# EAGLE design current_monitor_v1-1 (EAGLE 6.5.0)
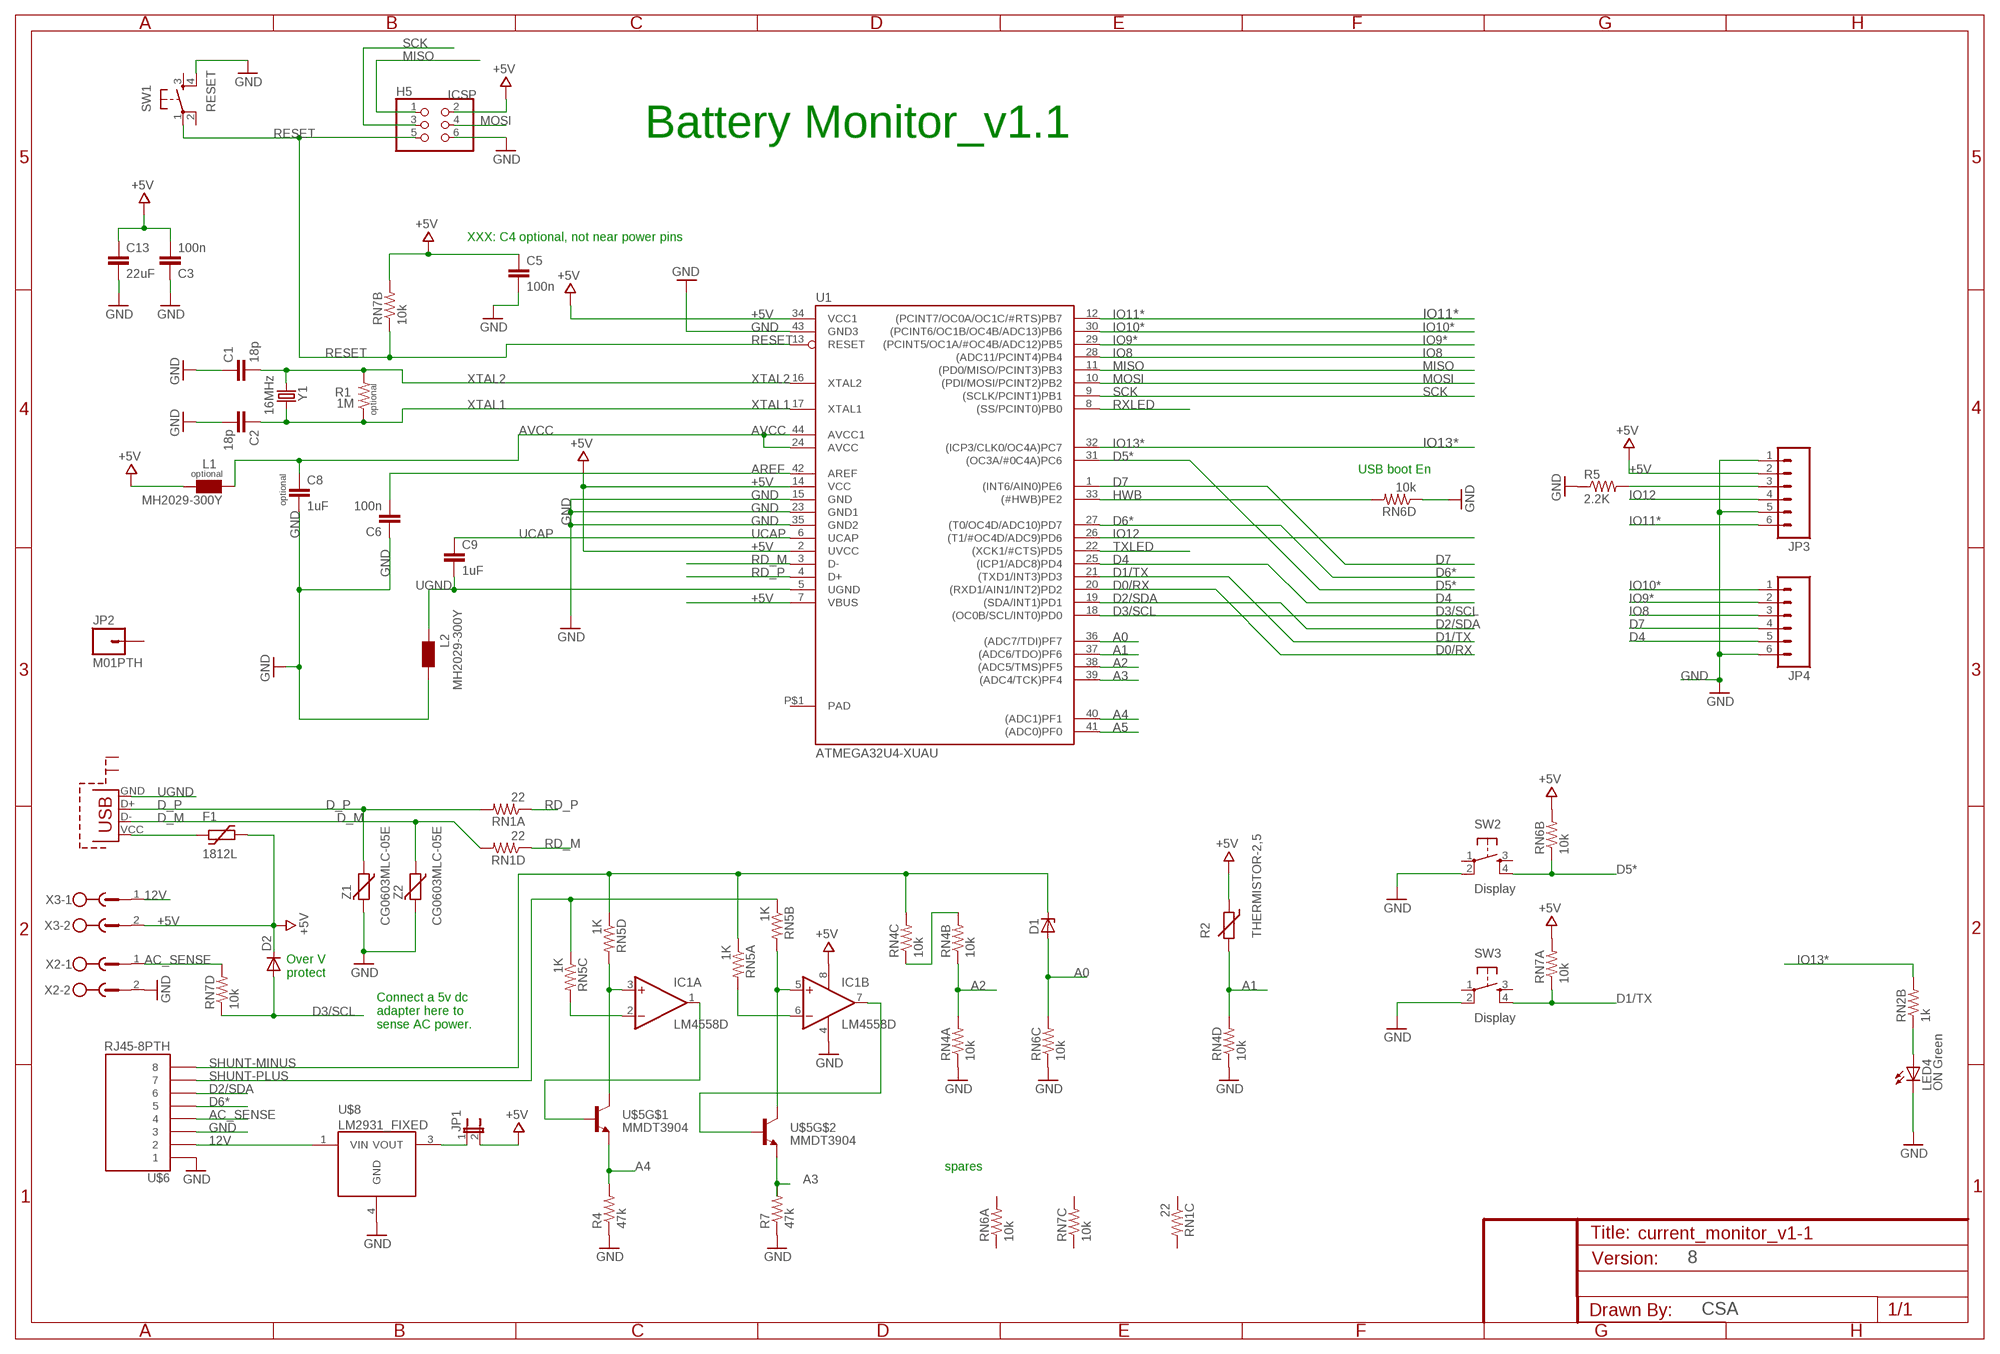
[diagram p0: schematic, sheet 1]

## Parts
C1  18p  CAP0805  [0805]
C2  18p  CAP0805  [0805]
C3  100n  CAP0805  [0805]
C5  100n  CAP0805  [0805]
C6  100n  CAP0805  [0805]
C8  1uF  CAP0805  [0805]
C9  1uF  CAP0805  [0805]
C13  22uF  CAP1206  [1206]
D1  ZENER-DIODEZD-5  [ZDIO-5]
D2  DIODESMA  [SMA-DIODE]
F1  1812L  [1812L]
H5  ICSP  PINHD-2X3  [2X03]
IC1  LM4558D  [SO08]
JP1  JUMPER-2-OLDPTH_LOCK  [1X02_LOCK]
JP2  M01PTH  [1X01]
JP3  M06FEMALE_LOCK  [1X06_FEMALE_LOCK.010]
JP4  M06FEMALE_LOCK  [1X06_FEMALE_LOCK.010]
L1  MH2029-300Y  WE-CBF_0805  [0805]
L2  MH2029-300Y  WE-CBF_0805  [0805]
LED4  ON Green  LED0805  [LED0805]
R1  1M  RESISTOR0805-RES  [0805]
R2  THERMISTOR-2,5  [RS-2,5]
R4  47k  RESISTOR0805-RES  [0805]
R5  2.2K  RESISTOR0805-RES  [0805]
R7  47k  RESISTOR0805-RES  [0805]
RN1  22  RESISTOR-ARRAYCRA06S  [CRA06S]
RN2  1k  RESISTOR-ARRAYCRA06S  [CRA06S]
RN4  10k  RESISTOR-ARRAYCRA06S  [CRA06S]
RN5  1K  RESISTOR-ARRAYCRA06S  [CRA06S]
RN6  10k  RESISTOR-ARRAYCRA06S  [CRA06S]
RN7  10k  RESISTOR-ARRAYCRA06S  [CRA06S]
SW1  RESET  TAC_SWITCHPTH  [TACTILE-PTH]
SW2  Display  TAC_SWITCHPTH  [TACTILE-PTH]
SW3  Display  TAC_SWITCHPTH  [TACTILE-PTH]
U1  ATMEGA32U4-XUAU  [TQFP44-PAD]
U$5  MMDT3904  [SOT363]
U$6  RJ45-8PTH  [RJ45-8]
U$8  LM2931_FIXED  [DPAK]
U$12  USB-MICRO-B-UNIVERSAL  [USB-MICRO-B-UNIVERSAL]
X2  MSTBV2  [MSTBV2]
X3  MSTBV2  [MSTBV2]
Y1  16MHz  CRYSTALHC49US  [HC49US]
Z1  CG0603MLC-05E  VARISTORCN0603  [CT/CN0603]
Z2  CG0603MLC-05E  VARISTORCN0603  [CT/CN0603]

## Nets
12V: U$6.2 U$8.1(VIN) X3.1
+5V [power]: C3.2 C5.1 C13.1 D2.C F1.P$2 H5.2 IC1.8(P:V+) JP1.2 JP3.2 L1.1 R2.1 RN6.7 RN7.7 RN7.8 U1.2(UVCC) U1.7(VBUS) U1.14(VCC) U1.34(VCC1) X3.2
A0: D1.A RN6.6 U1.36((ADC7/TDI)PF7)
A1: R2.2 RN4.5 U1.37((ADC6/TDO)PF6)
A2: RN4.2 RN4.8 U1.38((ADC5/TMS)PF5)
A3: R7.2 U1.39((ADC4/TCK)PF4) U$5.1(E)
A4: R4.2 U1.40((ADC1)PF1) U$5.4(E)
A5: U1.41((ADC0)PF0)
AC_SENSE: RN7.5 U$6.4 X2.1
AREF [aref]: C6.2 U1.42(AREF)
AVCC: C8.1 L1.2 U1.24(AVCC) U1.44(AVCC1)
D0/RX: U1.20((RXD1/AIN1/INT2)PD2)
D1/TX: RN7.1 SW3.4 U1.21((TXD1/INT3)PD3)
D2/SDA: U1.19((SDA/INT1)PD1) U$6.6
D3/SCL: D2.A RN7.4 U1.18((OC0B/SCL/INT0)PD0)
D4: JP4.5 U1.25((ICP1/ADC8)PD4)
D5*: RN6.2 SW2.4 U1.31((OC3A/#0C4A)PC6)
D6*: U1.27((T0/OC4D/ADC10)PD7) U$6.5
D7: JP4.4 U1.1((INT6/AIN0)PE6)
D_M: RN1.5 U$12.D- Z2.1
D_P: RN1.8 U$12.D+ Z1.1
GND [gnd]: C1.1 C2.2 C3.1 C5.2 C6.1 C8.2 C13.2 H5.6 IC1.4(P:V-) JP3.1 JP3.5 JP4.6 L2.2 LED4.C R4.1 R5.1 R7.1 RN4.1 RN4.4 RN6.3 RN6.4 SW1.4 SW2.2 SW3.2 U1.15(GND) U1.23(GND1) U1.35(GND2) U1.43(GND3) U$6.1 U$6.3 U$8.4(GND) X2.2 Z1.2 Z2.2
HWB: RN6.5 U1.33((#HWB)PE2)
IO8: JP4.3 U1.28((ADC11/PCINT4)PB4)
IO9*: JP4.2 U1.29((PCINT5/OC1A/#OC4B/ADC12)PB5)
IO10*: JP4.1 U1.30((PCINT6/OC1B/OC4B/ADC13)PB6)
IO11*: JP3.6 U1.12((PCINT7/OC0A/OC1C/#RTS)PB7)
IO12: JP3.4 U1.26((T1/#OC4D/ADC9)PD6)
IO13*: RN2.7 U1.32((ICP3/CLK0/OC4A)PC7)
LED4_ANODE: LED4.A RN2.2
MISO: H5.1 U1.11((PD0/MISO/PCINT3)PB3)
MOSI: H5.4 U1.10((PDI/MOSI/PCINT2)PB2)
N$1: IC1.5(B:+IN) RN5.7 U$5.6(C)
N$2: IC1.2(A:-IN) RN5.6
N$3: IC1.6(B:-IN) RN5.8
N$4: IC1.1(A:OUT) U$5.5(B)
N$5: IC1.7(B:OUT) U$5.2(B)
N$6: IC1.3(A:+IN) RN5.5 U$5.3(C)
N$7: F1.P$1 U$12.VCC(VBUS)
N$8: JP1.1 U$8.3(VOUT)
N$10: RN4.3 RN4.7
N$12: JP3.3 R5.2
RD_M: RN1.4 U1.3(D-)
RD_P: RN1.1 U1.4(D+)
RESET: H5.5 RN7.2 SW1.1 U1.13(RESET)
RXLED: U1.8((SS/PCINT0)PB0)
SCK: H5.3 U1.9((SCLK/PCINT1)PB1)
SHUNT-MINUS: D1.C RN4.6 RN5.1 RN5.4 U$6.8
SHUNT-PLUS: RN5.2 RN5.3 U$6.7
TXLED: U1.22((XCK1/#CTS)PD5)
UCAP: C9.1 U1.6(UCAP)
UGND [gnd]: C9.2 L2.1 U1.5(UGND) U$12.GND
XTAL1: C2.1 R1.1 U1.17(XTAL1) Y1.2
XTAL2: C1.2 R1.2 U1.16(XTAL2) Y1.1
Unconnected: JP2.1 RN1.2 RN1.3 RN1.6 RN1.7 RN2.1 RN2.3 RN2.4 RN2.5 RN2.6 RN2.8 RN6.1 RN6.8 RN7.3 RN7.6 SW1.2 SW1.3 SW2.1 SW2.3 SW3.1 SW3.3 U$12.P$7(SHIELD1) U$12.P$8(SHIELD2)

## Notes on the sheet
- Battery Monitor_v1.1
- XXX: C4 optional, not near power pins
- optional
- USB boot En
- optional
- optional
- Over V
  protect
- Connect a 5v dc
  adapter here to 
  sense AC power.
- spares
- 8
- CSA

## Power pins joined to a net without a drawn wire
PAD: U1.P$1(PAD)

## Library data of the parts
C1-C3 C5 C6 C8 C9 C13 = SparkFun-Passives:CAP: Capacitor Standard 0603 ceramic capacitor, and 0.1" leaded capacitor.
D1 = diode:ZENER-DIODE: Z-Diode
D2 = SparkFun-DiscreteSemi:DIODE: Diode These are standard reverse protection diodes and small signal diodes. SMA package can handle up to about 1A. SOD-323 can handle about 200mA. What the SOD-323 package when ordering, there are some mfgs out there that are 5-pin packages.
F1 = ptc-littlefuse:1812L
H5 = SmartPrj:PINHD-2X3: PIN HEADER
IC1 = linear:*4558: OP AMP
JP1 = SparkFun-Passives:JUMPER-2-OLD: Jumper Basic 0.1" spaced jumper. Use with breakaway headers.
JP2 = SparkFun-Connectors:M01: Header 1 Standard 1-pin 0.1" header. Use with straight break away headers (SKU : PRT-00116), right angle break away headers (PRT-00553), swiss pins (PRT-00743), machine pins (PRT-00117), and female headers (PRT-00115).
JP3 JP4 = SparkFun-Connectors:M06: Header 6 Standard 6-pin 0.1" header. Use with straight break away headers (SKU : PRT-00116), right angle break away headers (PRT-00553), swiss pins (PRT-00743), machine pins (PRT-00117), and female headers (PRT-00115). Molex polarized connector foot print use with SKU : PRT-08094 with associated crimp pins and housings. NOTES ON THE VARIANTS LOCK and LOCK_LONGPADS... This footprint was designed to help hold the alignment of a through-hole component (i.e. 6-pin header) while soldering it into place. You may notice that each hole has been shifted either up or down by 0.005 of an inch from it's more standard position (which is a perfectly straight line). This slight alteration caused the pins (the squares in the middle) to touch the edges of the holes. Because they are alternating, it causes a "brace" to hold the component in place. 0.005 has proven to be the perfect amount of "off-center" position when using our standard breakaway headers. Although looks a little odd when you look at the bare footprint, once you have a header in there, the alteration is very hard to notice. Also, if you push a header all the way into place, it is covered up entirely on the bottom side. This idea of altering the position of holes to aid alignment will be further integrated into the Sparkfun Library for other footprints. It can help hold any component with 3 or more connection pins.
L1 L2 = wuerth-elektronik:WE-CBF: SMD EMI Suppression Ferrite Beads - excellent anti-EMI properties - low DCR - impedances till 3000 ohms - rated current up to 6 A
LED4 = xorduino:LED
R1 R4 R5 R7 = SparkFun-Passives:RESISTOR: Resistor Basic schematic elements and footprints for 0603, 1206, and PTH resistors.
R2 = varistor:THERMISTOR: THERMISTOR
RN1 RN2 RN4-RN7 = xorduino:RESISTOR-ARRAY
SW1-SW3 = SparkFun-Electromechanical:TAC_SWITCH: Momentary Switch Button commonly used for reset or general input. Spark Fun Electronics SKU : COM-00097
U1 = SmartPrj:ATMEGA32U4-XU
U$5 = SparkFun-DiscreteSemi:MMDT3904: Dual NPN transistor
U$6 = SparkFun-Connectors:RJ45-8: RJ45 Jack Simple RJ45, 8-pin connection - connector for common Cat5, Cat5e, and Cat6 Ethernet cables. Footprint not yet proven in production. Connector sku is PRT-00643; Breakout PCB sku is BOB-00716.
U$8 = SparkFun-PowerIC:LM2931_FIXED: LDO regulator with reverse battery protection- very durable!
U$12 = _usb_micro_b:USB-MICRO-B: USB MICRO B SOCKET 2 shielded pins
X2 X3 = con-phoenix-500:MSTBV2: PHOENIX; OC_FARNELL: unknown; OC_NEWARK: unknown
Y1 = SparkFun-FreqCtrl:CRYSTAL: Various standard crystals. Proven footprints. Spark Fun Electronics SKU : COM-00534
Z1 Z2 = varistor:VARISTOR: VARISTOR

## Net classes
0 default: width 0.203 mm, drill 0.406 mm, clearance 0.205 mm
1 power: width 0.203 mm, drill 0.406 mm, clearance 0.205 mm to class 0, clearance 0.205 mm
2 gnd: width 0.203 mm, drill 0.406 mm, clearance 0.205 mm to class 0, clearance 0.205 mm to class 1, clearance 0.205 mm
3 usbvcc: width 0.203 mm, drill 0.406 mm, clearance 0.203 mm
4 aref: width 0.203 mm, drill 0.406 mm, clearance 0.205 mm to class 0, clearance 0.205 mm to class 1, clearance 0.205 mm to class 2, clearance 0.205 mm to class 3, clearance 0.205 mm

## Board
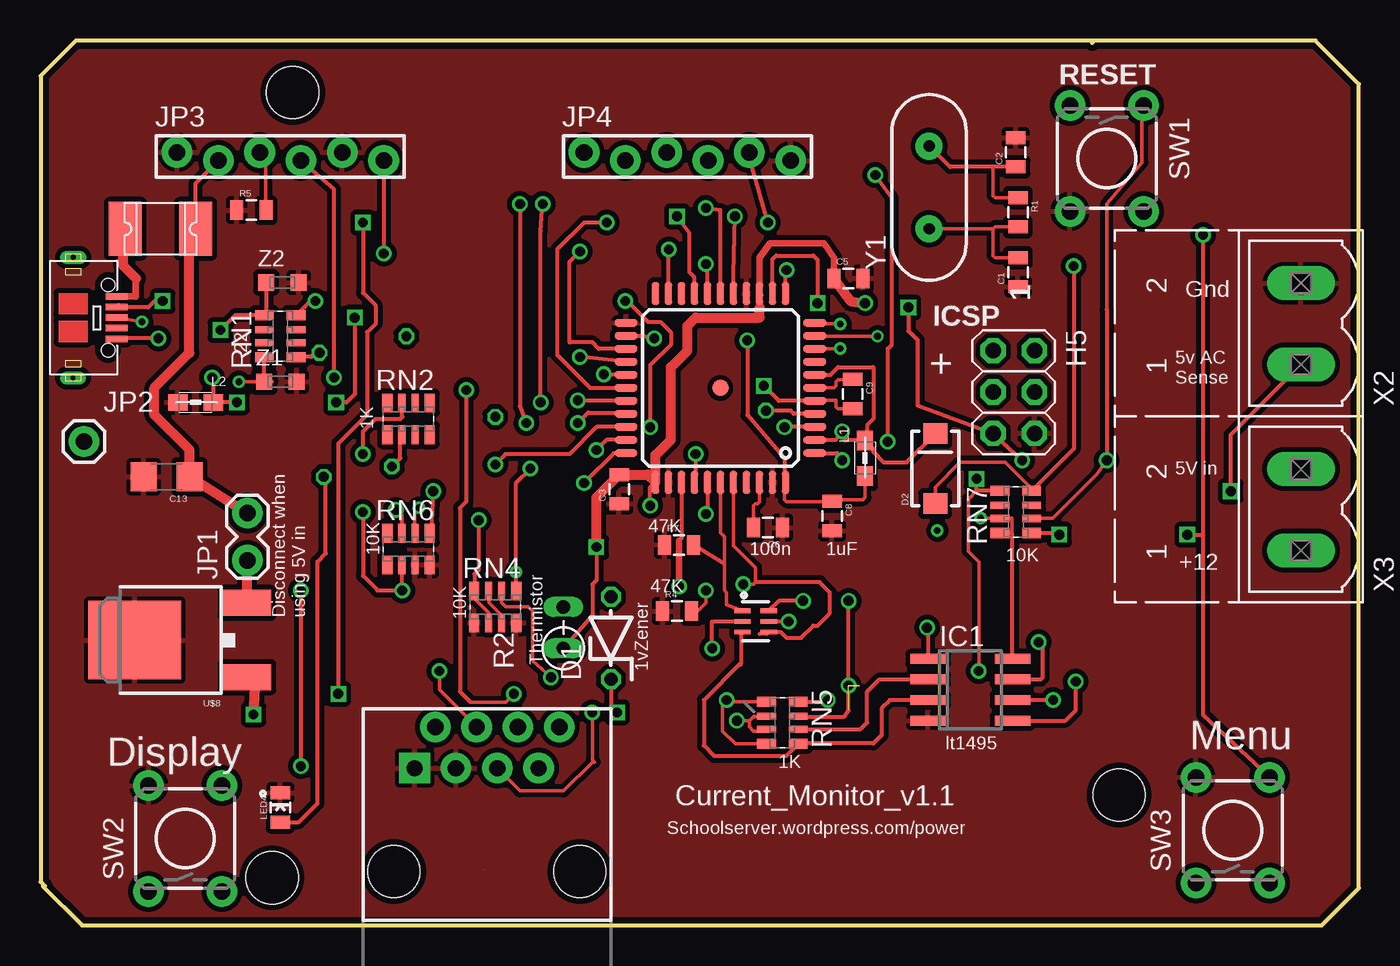
[diagram p1: board, top side]
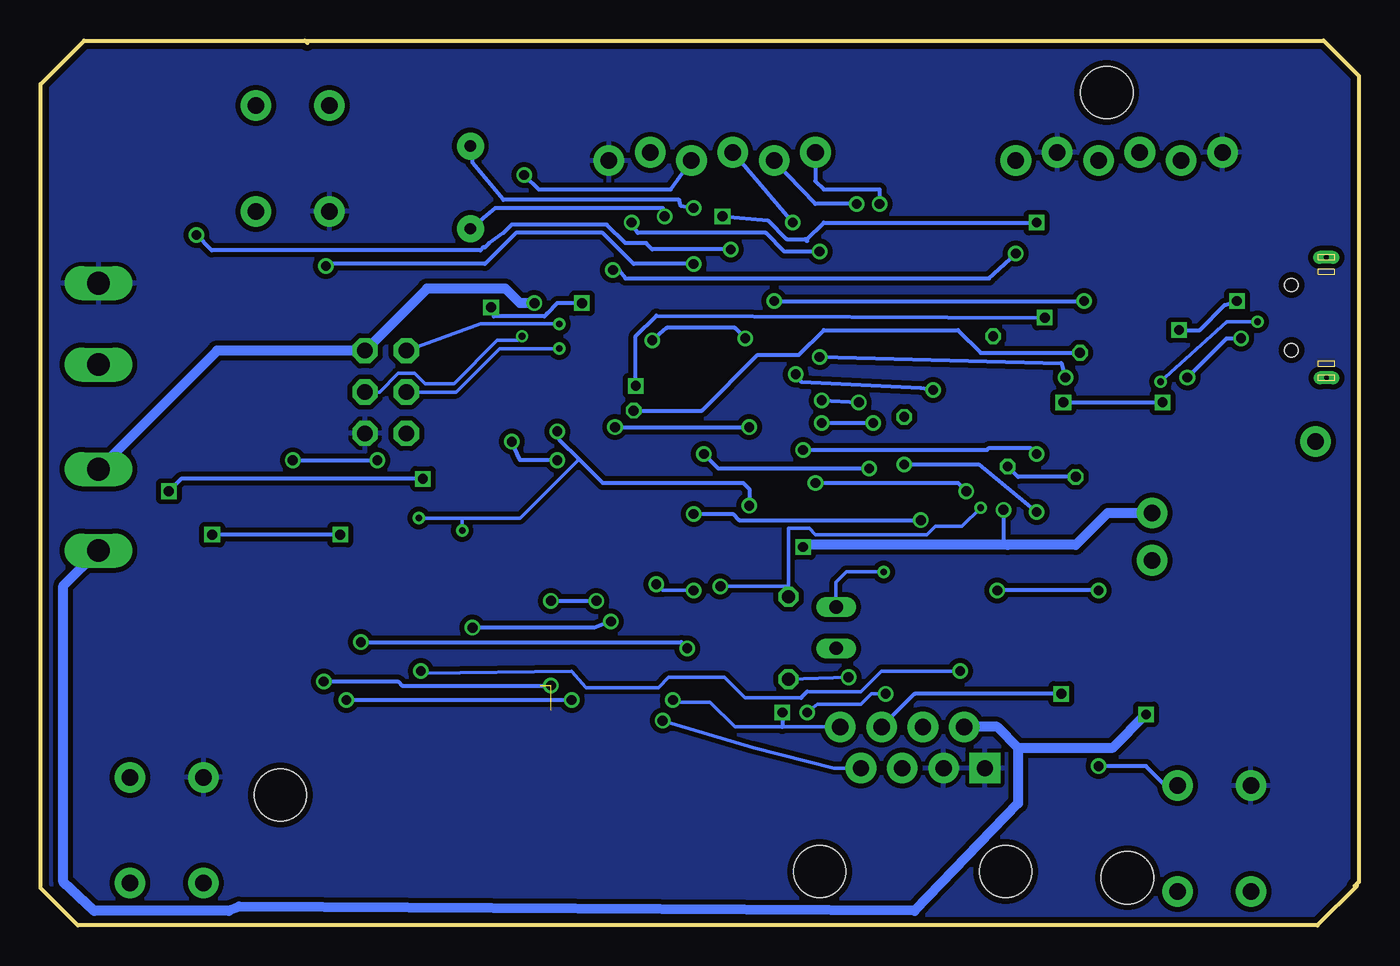
[diagram p2: board, bottom side, seen from below]

Size 81.03 x 54.36 mm. Coordinates in mm from the lower left corner, seen from the top.
Outline: 0.13,2.54 0.13,2.41 2.54,0 78.74,0 81.03,2.29 81.03,51.69 78.36,54.36 64.77,54.36
Outline: 64.77,54.36 2.16,54.36 0,52.2 0,2.67 0.25,2.41
Outline: 64.77,54.36 64.64,54.23
Copper layers (1*16): Top 0.0356mm / dielectric 1.5011mm / Bottom 0.0356mm
Design rules "LaenPCBOrder": minimum track width 6mil, minimum drill 13mil, track to track 6mil, track to pad 6mil, pad to pad 6mil, via to via 6mil, smd to smd 6mil, copper to edge 15mil, drill to drill 6mil, minimum pad ring 7mil, minimum via ring 7mil, stop-mask expansion 4mil, vias tented up to drill 0mil, thermal gap 10mil
Holes 3.2 mm at 66.29,8 15.49,51.18 14.22,2.92

### Footprints (pad centres in the part's own frame; a part is rotated, then mirrored left to right if it is on the bottom)
0805 = smd 0.8 x 1.2: 1 -0.9,0; 2 0.9,0
1206 = smd 1.6 x 1.8: 1 -1.4,0; 2 1.4,0
ZDIO-5 = drill 0.813 octagon: A 2.54,0; C -2.54,0
SMA-DIODE = smd 1.27 x 1.47: A -2.15,0; C 2.15,0
1812L = smd 2.03 x 3.3: P$1 -2.16,0; P$2 2.16,0
2X03 = drill 0.95 pad 1.55 octagon: 1 -2.54,-1.27; 2 -2.54,1.27; 3 0,-1.27; 4 0,1.27; 5 2.54,-1.27; 6 2.54,1.27
SO08 = smd 0.6 x 2.2: 1 -1.905,-2.6; 2 -0.635,-2.6; 3 0.635,-2.6; 4 1.905,-2.6; 5 1.905,2.6; 6 0.635,2.6; 7 -0.635,2.6; 8 -1.905,2.6
1X02_LOCK = drill 1.016 pad 1.88: 1 -0.178,0; 2 2.718,0
1X01 = drill 1.016 pad 1.88: 1 0,0
1X06_FEMALE_LOCK.010 = drill 1.016 pad 1.88: 1 0,0.254; 2 2.54,-0.254; 3 5.08,0.254; 4 7.62,-0.254; 5 10.16,0.254; 6 12.7,-0.254
0805' = smd 1.2 x 1: 1 -1.1,0; 2 1.1,0
LED0805 = smd 0.8 x 1.2: A -0.9,0; C 0.9,0
RS-2,5 = drill 0.813 long: 1 -1.27,0; 2 1.27,0
CRA06S = smd 0.63 x 1.15: 1 -1.295,-0.975; 4 1.295,-0.975; 5 1.295,0.975; 8 -1.295,0.975 | smd 0.44 x 1.15: 2 -0.4,-0.975; 3 0.4,-0.975; 6 0.4,0.975; 7 -0.4,0.975
TACTILE-PTH = drill 1.016 pad 1.88: 1 -3.251,2.261; 2 3.251,2.261; 3 -3.251,-2.261; 4 3.251,-2.261
TQFP44-PAD = smd 1.4 x 0.45: 1 -5.8,4; 2 -5.8,3.2; 3 -5.8,2.4; 4 -5.8,1.6; 5 -5.8,0.8; 6 -5.8,0; 7 -5.8,-0.8; 8 -5.8,-1.6; 9 -5.8,-2.4; 10 -5.8,-3.2; 11 -5.8,-4; 23 5.8,-4; 24 5.8,-3.2; 25 5.8,-2.4; 26 5.8,-1.6; 27 5.8,-0.8; 28 5.8,0; 29 5.8,0.8; 30 5.8,1.6; 31 5.8,2.4; 32 5.8,3.2; 33 5.8,4 | smd 0.45 x 1.4: 12 -4,-5.8; 13 -3.2,-5.8; 14 -2.4,-5.8; 15 -1.6,-5.8; 16 -0.8,-5.8; 17 0,-5.8; 18 0.8,-5.8; 19 1.6,-5.8; 20 2.4,-5.8; 21 3.2,-5.8; 22 4,-5.8; 34 4,5.8; 35 3.2,5.8; 36 2.4,5.8; 37 1.6,5.8; 38 0.8,5.8; 39 0,5.8; 40 -0.8,5.8; 41 -1.6,5.8; 42 -2.4,5.8; 43 -3.2,5.8; 44 -4,5.8 | smd 1 x 1: P$1 0,0
SOT363 = smd 0.3 x 0.99: 1 -0.65,-0.8; 2 0,-0.8; 3 0.65,-0.8; 4 0.65,0.81; 5 0,0.81; 6 -0.65,0.81
RJ45-8 = drill 1 pad 1.88 square: 1 -4.445,6.35 | drill 1 pad 1.88: 2 -3.175,8.89; 3 -1.905,6.35; 4 -0.635,8.89; 5 0.635,6.35; 6 1.905,8.89; 7 3.175,6.35; 8 4.445,8.89 | hole 3.2: -5.715,0; 5.715,0
DPAK = smd 1.6 x 3: 1 -2.28,-5.31; 3 2.28,-5.31 | smd 4.826 x 5.715: 4 0,1.588
USB-MICRO-B-UNIVERSAL = smd 0.4 x 1.35: D+ 0,-0.03; D- -0.65,-0.03; GND 1.3,-0.03; ID 0.65,-0.03; VCC -1.3,-0.03 | drill 0.3 pad 0.813 long: P$7 3.7,-2.71; P$8 -3.7,-2.7 | hole 0.8: -2,-0.55; 2,-0.55
MSTBV2 = drill 1.397 long: 1 -2.5,0; 2 2.5,0
HC49US = drill 0.7 pad 1.651: 1 -2.54,0; 2 2.54,0
CT/CN0603 = smd 1 x 1: 1 -1,0; 2 1,0

### Placement (x,y rotation side)
C1  60.07,40.13 90 top
C2  59.94,47.5 90 top
C3  35.56,26.8 90 top
C5  49.66,39.75 0 top
C6  44.7,24.43 180 top
C8  48.64,25.15 270 top
C9  49.91,32.64 270 top
C13  7.75,27.56 180 top
D1  35.05,17.65 90 top
D2  54.99,28.07 90 top
F1  7.37,42.8 0 top
H5  59.82,32.77 270 top
IC1  57.15,14.48 270 top
JP1  12.7,22.61 90 top
JP2  2.67,29.72 0 top
JP3  8.38,47.24 0 top
JP4  33.4,47.24 0 top
L1  MH2029-300Y  [0805']  50.67,28.7 270 top
L2  MH2029-300Y  [0805']  9.53,32.13 180 top
LED4  14.73,7.24 90 top
R1  60.07,43.81 270 top
R2  32.13,18.29 90 top
R4  39.12,19.3 0 top
R5  12.95,43.94 0 top
R7  39.24,23.37 0 top
RN1  14.73,36.2 90 top
RN2  22.61,31.12 0 top
RN4  27.94,19.56 0 top
RN5  45.59,12.45 270 top
RN6  22.61,23.11 0 top
RN7  59.94,25.4 90 top
SW1  65.53,47.12 270 top
SW2  8.89,5.33 90 top
SW3  73.28,5.84 90 top
U1  41.78,33.02 180 top
U$5  43.94,18.67 270 top
U$6  27.43,3.3 0 top
U$8  7.37,17.53 90 top
U$12  4.7,37.34 270 top
X2  77.47,36.96 90 top
X3  77.47,25.53 90 top
Y1  54.61,45.34 90 top
Z1  14.73,33.4 0 top
Z2  14.86,39.5 0 top

### Tracks (layer width: path | path; a pad name or v marks a point on that pad's centre or on a via)
12V  (via drill 0.6)
  Top 0.254: U$8.1 12.68,15.14 12.7,15.11 12.7,15.24 13.08,15.24 13.21,15.11
  Top 0.61: v13.08,12.95 13.21,15.11
  Bottom 0.61: 20.96,10.92 22.23,12.19 U$6.2 | 20.96,10.92 20.96,7.49 27.3,0.89 68.83,1.14 69.47,0.89 77.72,0.89 79.63,2.67 79.63,20.87 X3.1 | 20.96,10.92 15.11,10.92 v13.08,12.95
+5V  (via drill 0.41, 0.6)
  Top 0.203: 44.07,38.61 44.2,38.73 U1.14 | RN7.8 59.06,24.13 59.69,24.13 59.69,25.02 59.06,25.02 RN7.7 58.93,25.02 v57.78,25.02
  Top 0.254: 44.2,38.83 U1.14 44.24,38.82 44.32,38.73 | 48.77,39.74 C5.1 | U1.2 48.87,29.82 v49.28,30.35 49.45,29.8 L1.1 | v37.47,25.78 37.47,26.9 U1.34 | U1.7 48.55,33.82 49.02,34.29 51.18,34.29 51.18,31.12 50.8,30.73 50.8,29.93 L1.1 | v34.16,23.24 34.16,21.21 33.91,20.96 33.91,19.05 R2.1 | RN6.7 22.21,25.16 v21.84,25.53 | JP3.2 9.53,45.59 F1.P$2 9.14,42.42 | D2.C 53.22,28.45 51.82,28.45 51.18,29.08 51.18,29.29 L1.1 | 59.69,24.13 59.69,16.44 IC1.8
  Top 0.305: 44.2,37.97 44.2,38.81 U1.14
  Top 0.406: C5.1 48.76,41.03 48.13,41.91 44.83,41.91 44.2,41.02 44.2,38.83
  Top 0.61: JP1.2 C13.1 9.15,29.21 6.99,31.37 6.99,33.02 9.14,35.18 9.14,42.42 | v34.16,23.24 34.16,26.3 C3.2 37.31,27.7 U1.34 37.78,28.89 38.73,29.84 38.73,34.29 39.75,35.31 39.75,36.83 40.26,37.34 44.2,37.34 44.2,37.97 | 48.77,39.74 49.78,38.35 v50.67,38.23
  Bottom 0.203: 55.12,25.02 51.56,25.02 47.94,28.64 | 55.12,25.02 v57.78,25.02 | 55.12,25.02 v55.12,24.26
  Bottom 0.254: v49.28,30.35 49.15,29.84 47.94,28.64 46.48,27.18 37.85,27.18 37.47,26.8 v37.47,25.78 | v21.84,25.53 21.84,23.62 21.59,23.37
  Bottom 0.61: JP1.2 15.44,25.32 17.4,23.37 21.59,23.37 34.04,23.37 v34.16,23.24 | v50.67,38.23 51.56,38.23 52.45,39.12 57.28,39.12 H5.2 70.19,35.31 X3.2
A0  (via drill 0.41, 0.6)
  Top 0.203: v23.24,25.65 22.99,25.4 22.99,24.13 RN6.6
  Top 0.254: U1.36 39.38,23.76 39.24,23.62
  Top 0.406: 39.24,23.62 v39.24,20.83
  Bottom 0.203: v23.24,25.65 24.38,24.51 26.04,24.51 26.54,24 33.4,24 33.78,24.38 35.05,24.38 35.05,20.83 | D1.A 35.05,20.83 | 35.05,20.83 v39.24,20.83
A1  (via drill 0.41, 0.6)
  Top 0.203: v29.21,21.72 29.23,21.72
  Top 0.254: RN4.5 29.23,21.72 29.23,27.2 v30.1,28.07 | v40.26,28.96 40.26,27.3 U1.37
  Bottom 0.203: R2.2 32.13,21.08 31.5,21.72 v29.21,21.72
  Bottom 0.254: v30.1,28.07 39.37,28.07 v40.26,28.96
A2  (via drill 0.6)
  Top 0.203: RN4.8 26.67,20.45 26.67,20.07 27.56,19.18 27.56,18.67 RN4.2
  Top 0.254: U1.38 40.98,25.36 v40.89,25.27 | v26.92,24.89 26.92,21.84 26.67,21.59 26.67,20.56 RN4.8
  Bottom 0.254: v40.89,25.27 38.48,25.27 38.1,24.89 v26.92,24.89
A3
  Top 0.203: 42.04,22.23 42.04,20.57 42.16,20.45 42.16,19.68 U$5.1 | U1.39 41.78,24.13 42.04,23.88 42.04,22.23 | 42.04,22.23 R7.2
A4  (via drill 0.6)
  Top 0.203: U1.40 42.58,23.33 43.94,21.97 43.94,21.08 43.82,20.96 v43.18,20.96 | 44.2,17.91 44.64,17.91 | R4.2 40.39,19.3 40.89,19.81 v40.89,20.57
  Top 0.254: U$5.4 44.64,17.91 | 44.2,17.91 44.32,18.03 45.47,18.03 45.85,17.65 46.74,17.65 47.5,18.41 47.75,18.41 48.51,19.18 48.51,20.45 47.88,21.08 43.94,21.08
  Bottom 0.203: v40.89,20.57 42.8,20.57 v43.18,20.96
AC_SENSE  (via drill 0.6)
  Top 0.203: U$6.4 24.51,14.48 v24.51,15.62 | v57.66,15.62 57.66,22.35 57.02,22.99 57.02,26.19 57.53,26.7
  Top 0.254: RN7.5 57.53,26.7 v57.53,27.43 | v73.15,26.67 73.15,30.14 X2.1
  Bottom 0.203: v24.51,15.62 29.34,15.62 30.61,14.35 33.91,14.35 | 34.29,13.97 37.72,13.97 38.99,15.24 42.42,15.24 43.05,14.61 47.5,14.61 48.39,15.62 57.53,15.49 v57.66,15.62
  Bottom 0.254: v57.53,27.43 72.39,27.43 v73.15,26.67 | 33.91,14.35 34.29,13.97
AREF
  Top 0.203: C6.2 43.82,24.51 43.82,25.78 43.94,25.91 44.07,25.91 44.2,26.04 44.2,27.18 U1.42
AVCC  (via drill 0.6)
  Top 0.203: 47.5,26.04 45.85,26.04 45.72,26.16 45.72,27.18 U1.44 | L1.2 50.67,26.29 50.55,26.16 49.28,26.16 49.15,26.04 47.5,26.04 | 47.5,26.04 C8.1
  Top 0.254: U1.24 37.06,36.22 v37.72,36.07 | v43.43,35.94 43.43,31.37 45.72,28.7 45.72,27.28 U1.44
  Bottom 0.254: v37.72,36.07 38.35,36.7 42.55,36.7 v43.43,35.94
D1/TX  (via drill 0.6)
  Top 0.254: U1.21 38.58,41.5 v38.61,41.53 | v71.45,42.42 71.45,24 | 71.45,24 71.45,12.93 SW3.4 | RN7.1 62.61,24.11 v62.61,24 | v70.48,24 71.45,24
  Bottom 0.254: v38.61,41.53 43.43,41.53 43.82,41.91 45.09,41.91 46.23,43.05 52.07,43.05 52.58,42.55 53.47,41.91 53.72,41.66 53.82,41.66 54,41.48 70.51,41.48 v71.45,42.42 | v62.61,24 v70.48,24
D2/SDA  (via drill 0.6)
  Top 0.254: U1.19 40.18,39.83 39.88,40.13 39.88,42.55 v39.12,43.56 | v19.81,43.18 19.81,38.86 20.57,38.1 20.57,36.96 20.07,36.45 20.07,31.37 18.29,29.59 v18.29,14.22
  Bottom 0.254: v39.12,43.56 36.32,43.31 35.18,42.16 34.04,42.16 33.91,42.04 33.91,42.16 32.89,43.18 v19.81,43.18 | v18.29,14.22 27.3,14.22 U$6.6
D3/SCL  (via drill 0.6)
  Top 0.203: RN7.4 60.92,26.84 59.31,28.45 56.52,28.45 54.99,26.92 D2.A
  Top 0.254: U1.18 40.98,40.6 v40.89,40.64 | v63.5,40.51 63.5,29.28 RN7.4
  Bottom 0.254: v40.89,40.64 44.58,40.64 46.48,42.55 51.82,42.55 53.72,40.64 63.37,40.64 v63.5,40.51
D4  (via drill 0.6)
  Top 0.254: U1.25 34.3,35.42 33.91,35.81 32.51,35.81 32.51,40.77 v33.15,41.4 | v44.7,43.18 43.69,46.74 JP4.5
  Bottom 0.254: v33.15,41.4 35.31,41.4 36.45,42.55 44.32,42.55 v44.7,43.18
D5*  (via drill 0.6)
  Top 0.254: RN6.2 22.23,22.12 v22.23,20.57 20.7,20.57 19.81,21.46 v19.81,25.4 | U1.31 34.18,30.62 32.51,28.96 28.58,28.96 v27.94,28.32 | v16,9.78 v16,20.57
  Bottom 0.254: SW2.4 11.89,8.59 13.08,9.78 v16,9.78 | v16,20.57 v22.23,20.57 | v27.94,28.32 23.37,28.32 v19.81,25.4
D6*  (via drill 0.6)
  Top 0.203: 26.42,13.72 28.58,13.72 v29.08,14.22 | v33.91,13.08 33.91,10.16 34.04,10.03 33.91,10.03 32.13,8.25 29.46,8.25 U$6.5
  Top 0.254: U1.27 34.84,33.82 v34.62,33.86 | v26.16,32.89 26.16,26.04 25.78,25.65 25.78,14.35 26.42,13.72
  Bottom 0.203: v29.08,14.22 29.97,14.22 30.61,13.59 33.27,13.59 v33.91,13.08
  Bottom 0.254: v34.62,33.86 34.67,33.78 34.29,33.4 26.92,33.02 v26.16,32.89
D7  (via drill 0.6)
  Top 0.254: U1.1 48.96,29.02 v49.28,28.57 | v52.07,29.72 52.07,35.43 52.32,35.69 52.32,44.7 v51.31,46.1
  Bottom 0.254: v49.28,28.57 51.56,28.57 v52.07,29.72 | v51.31,46.1 50.42,45.21 42.29,45.21 JP4.4
D_M  (via drill 0.6)
  Top 0.254: v11.05,36.58 11.96,37.49 RN1.5 13.86,37.59 Z2.1 | 4.78,38.1 U$12.D- 4.68,37.97 6.6,37.97 6.99,38.35 v7.49,38.35
  Bottom 0.254: v11.05,36.58 9.78,36.58 8.26,38.1 v7.49,38.35
D_P  (via drill 0.41)
  Top 0.203: 14.22,33.4 Z1.1 v12.19,33.4 | v6.22,37.08 U$12.D+
  Top 0.254: Z1.1 13.73,34.88 RN1.8
  Bottom 0.203: v6.22,37.08 8.13,37.08 v12.19,33.4
GND
  pour Bottom (isolate 0.305): 0.25,1.65 0.25,52.45 1.52,53.72 81.15,54.1 81.03,0.13 2.79,0.38
  pour Top (isolate 0.305): 0.25,1.65 0.25,52.45 1.52,53.72 81.28,54.23 80.77,0 2.29,0.38
HWB  (via drill 0.6)
  Top 0.254: U1.33 35.24,29.02 v33.4,27.18 | v24.13,26.67 24,24.19 RN6.5
  Bottom 0.254: v33.4,27.18 24.64,27.18 v24.13,26.67
IO8  (via drill 0.6)
  Top 0.254: v34.8,43.18 33.4,43.18 31.75,41.53 31.75,35.05 33.78,33.02 U1.28
  Bottom 0.254: v34.8,43.18 JP4.3
IO9*  (via drill 0.6)
  Top 0.254: U1.29 33.06,32.22 v33.02,32.26 | v30.73,32.13 30.73,42.67 v30.86,44.32
  Bottom 0.254: v33.02,32.26 v30.73,32.13 | v30.86,44.32 33.4,44.32 JP4.2
IO10*  (via drill 0.6)
  Top 0.203: 36.07,31.37 U1.30
  Top 0.254: v29.46,44.32 29.46,31.88 v29.84,30.86 | v33.02,30.86 33.66,31.5 35.91,31.5 U1.30 | 36.07,31.37 35.94,31.5
  Bottom 0.254: JP4.1 33.4,45.72 32.89,45.21 29.46,45.21 v29.46,44.32 | v29.84,30.86 v33.02,30.86
IO11*  (via drill 0.6)
  Top 0.254: U1.12 45.78,40.2 v45.85,40.26 | JP3.6 v21.08,41.27
  Bottom 0.254: v45.85,40.26 45.47,40.26 45.09,39.75 22.73,39.75 v21.08,41.27
IO12  (via drill 0.6)
  Top 0.254: U1.26 33.73,34.87 v33.15,34.92 | v18.03,33.66 18.03,45.21 JP3.4
  Bottom 0.254: v33.15,34.92 18.29,34.54 v18.03,33.66
IO13*  (via drill 0.6)
  Top 0.254: U1.32 34.77,29.82 v34.16,29.21 | v19.81,28.96 19.81,30.35 20.57,31.12 22.1,31.12 22.23,31.24 22.23,32.07 RN2.7
  Bottom 0.254: v34.16,29.21 22.86,29.21 22.73,29.34 20.19,29.34 v19.81,28.96
LED4_ANODE  (via drill 0.6)
  Top 0.254: LED4.A 15.86,6.34 17.02,7.49 17.02,22.35 17.53,22.86 17.53,27.43 v17.4,27.56 | v21.59,28.19 22.1,28.7 22.1,30.03 RN2.2
  Bottom 0.254: v17.4,27.56 20.96,27.56 v21.59,28.19
MISO  (via drill 0.41)
  Top 0.203: v49.15,36.96 47.62,36.96 U1.11
  Bottom 0.203: v49.15,36.96 53.98,36.96 H5.1
MOSI  (via drill 0.41)
  Top 0.203: v51.44,36.2 47.62,36.2 U1.10
  Bottom 0.203: H5.4 60.2,32.77 59.06,33.91 58.04,33.91 57.4,33.27 55.63,33.27 52.96,35.94 51.69,35.94 v51.44,36.2
N$1  (via drill 0.6)  (3 unrouted)
  Top 0.203: 46.59,12.83 RN5.7
  Top 0.254: 46.59,12.83 49.4,12.83 49.66,13.21 v49.66,19.94 | v46.86,19.94 45.37,19.94 U$5.6 | IC1.5 62.99,12.57 63.63,13.21 v63.63,14.99
  Bottom 0.254: v49.66,19.94 v46.86,19.94 | v63.63,14.99 59.06,14.99 58.8,14.73 v49.66,14.73
N$2
  Top 0.254: RN5.6 50.4,12.05 50.8,12.45 50.8,14.35 51.56,15.11 IC1.2
N$3  (via drill 0.6)
  Top 0.254: RN5.8 48.29,13.74 v48.39,13.84 | v62.23,13.84 IC1.6
  Bottom 0.254: v48.39,13.84 v62.23,13.84
N$4  (via drill 0.6)
  Top 0.254: U$5.5 v45.97,18.67 | v54.48,18.29 54.55,17.71 IC1.1
  Bottom 0.254: v45.97,18.67 46.99,18.29 v54.48,18.29
N$5  (via drill 0.6)
  Top 0.254: IC1.7 61.47,15.11 61.59,15.24 61.59,17.14 v61.34,17.4 | v41.27,17.02 41.27,18.67 U$5.2
  Bottom 0.254: v61.34,17.4 41.66,17.4 v41.27,17.02
N$6
  Top 0.203: 43.05,16 42.99,16.06
  Top 0.254: U$5.3 43.05,18.02 43.05,16.13 42.99,16.06 40.77,13.84 40.77,11.05 41.4,10.41 45.83,10.41 RN5.5 46.59,11.18 51.18,11.18 51.69,11.68 51.69,13.34 52.2,13.84 IC1.3
N$7
  Top 0.406: U$12.VCC 5.81,38.64 5.84,38.61 5.84,39.75
  Top 0.61: 5.84,39.75 5.08,40.51 5.08,42.67 F1.P$1
N$8
  Top 0.61: U$8.3 12.7,19.81 JP1.1
N$9  (via drill 0.6)
  other vias: 27.94,31.24
N$10
  Top 0.203: RN4.7 27.56,20.45 27.56,19.81 28.32,19.05 28.32,18.67 RN4.3
N$12
  Top 0.203: JP3.3 13.84,47.12 R5.2
N$24  (via drill 0.6)
  other vias: 22.48,36.2
RD_M  (via drill 0.6)
  Top 0.254: U1.3 v45.73,30.62 v45.72,30.61 | v16.89,38.35 16.57,38.35 RN1.4 | v35.94,38.35 36.07,38.35 37.34,37.08 38.1,37.08 38.73,36.45 38.73,35.69 37.47,34.42 v37.47,30.61
  Bottom 0.254: v45.72,30.61 v37.47,30.61 | v35.94,38.35 v16.89,38.35
RD_P  (via drill 0.6)
  Top 0.254: U1.4 46.3,31.42 46.1,31.62 v44.58,31.62 | v17.15,35.18 16.89,35.18 16.64,34.92 15.73,34.92 RN1.1
  Bottom 0.254: v44.58,31.62 40.39,31.62 36.96,35.05 34.42,35.05 32.89,36.58 24.64,36.58 23.24,35.18 v17.15,35.18
RESET  (via drill 0.6)
  Top 0.203: 65.53,37.85 65.53,44.32 67.69,46.86 67.69,50.29 SW1.1 | v65.53,28.57 64.9,27.69 62.23,25.02 60.96,25.02 RN7.2
  Top 0.254: U1.13 44.98,40.92 45.21,41.15 47.5,41.15 47.75,40.89 v47.75,38.23 | v53.34,37.97 53.34,36.52 53.9,35.97 53.9,31.95 H5.5 58.8,29.97 v60.33,28.57 | 65.53,37.85 v65.53,28.57
  Bottom 0.254: v47.75,38.23 49.28,38.23 49.91,37.59 49.91,37.57 50.06,37.41 53.16,37.41 v53.34,37.97 | v65.53,28.57 v60.33,28.57
SCK  (via drill 0.41)
  Top 0.203: v49.15,35.43 47.62,35.43 U1.9
  Bottom 0.203: v49.15,35.43 52.83,35.43 55.5,32.77 H5.3
SHUNT-MINUS  (via drill 0.6)
  Top 0.203: RN5.1 42.27,13.74 v42.16,13.84 41.91,13.59 41.91,11.94 42.7,11.15 RN5.4 | RN4.6 28.34,19.83 28.32,19.81 28.58,19.56 29.97,19.56 30.23,19.3 30.23,16.26 v31.37,15.24
  Top 0.254: D1.C 35.05,13.34 v35.43,13.08
  Bottom 0.203: U$6.8 35.43,12.19 38.35,12.19 39.88,13.72 42.04,13.72 v42.16,13.84 | v31.37,15.24 D1.C
  Bottom 0.254: v35.43,13.08 35.43,12.19
SHUNT-PLUS  (via drill 0.6)
  Top 0.203: 43.83,12.85 43.82,12.83 | 43.82,12.83 43.56,12.57 | 43.56,12.57 43.56,12.19 43.82,11.94 44.58,11.94 RN5.3 | v42.8,12.57 43.56,12.57 | 43.82,12.83 44.58,12.83 RN5.2
  Bottom 0.203: U$6.7 32.26,9.65 37.21,10.92 v42.8,12.57
UCAP
  Top 0.203: U1.6 48.77,33.02 48.9,33.15 48.9,33.4 49.02,33.53 50.42,33.53 C9.1
UGND  (via drill 0.6)
  Top 0.203: C9.2 50.42,31.75 49.02,31.75 48.9,31.88 48.9,32.26 47.62,32.26 U1.5
  Top 0.254: v10.54,33.66 10.63,33.57 L2.1 v12.06,32.13 | v7.24,36.07 4.7,36.07 U$12.GND | U1.5 45.38,32.22 v44.45,33.15 | v19.3,37.34 19.3,32.64 18.8,32.13 v18.16,32.13
  Bottom 0.254: v10.54,33.66 8.13,36.07 v7.24,36.07 | v44.45,33.15 44.45,36.2 43.18,37.47 v19.3,37.34 | v18.16,32.13 v12.06,32.13
XTAL1  (via drill 0.6)
  Top 0.203: 58.55,46.6 58.55,44.83 58.67,44.7 R1.1
  Top 0.254: U1.17 41.78,43.94 v40.89,44.07 | C2.1 58.55,46.6 55.89,46.6 Y1.2
  Bottom 0.254: v40.89,44.07 41.66,44.2 41.78,44.58 52.58,44.58 54.48,46.86 54.48,47.75 Y1.2
XTAL2  (via drill 0.6)
  Top 0.203: 58.55,42.8 58.55,41.15 58.67,41.02 C1.2 | 58.55,42.8 58.67,42.93 60.07,42.93 R1.2 | Y1.1 58.55,42.8
  Top 0.254: U1.16 42.55,38.82 v42.67,43.56
  Bottom 0.254: v42.67,43.56 42.8,44.07 53.09,44.07 Y1.1

### Text on the board
tPlace: RESET | 1 | Gnd | ICSP | 22 | + | 5v AC / Sense | 1K | 5V in | 47K | 10K | 100n | 1uF | 10K | +12 | 47K | Disconnect when / using 5V in | 10K | Thermistor | 1vZener | lt1495 | Menu | Display | 1K | Current_Monitor_v1.1 | Schoolserver.wordpress.com/power
tValues: Display | Display | To Battery | Menu